# Altium schematic sheet Sheet1.SchDoc
size A4
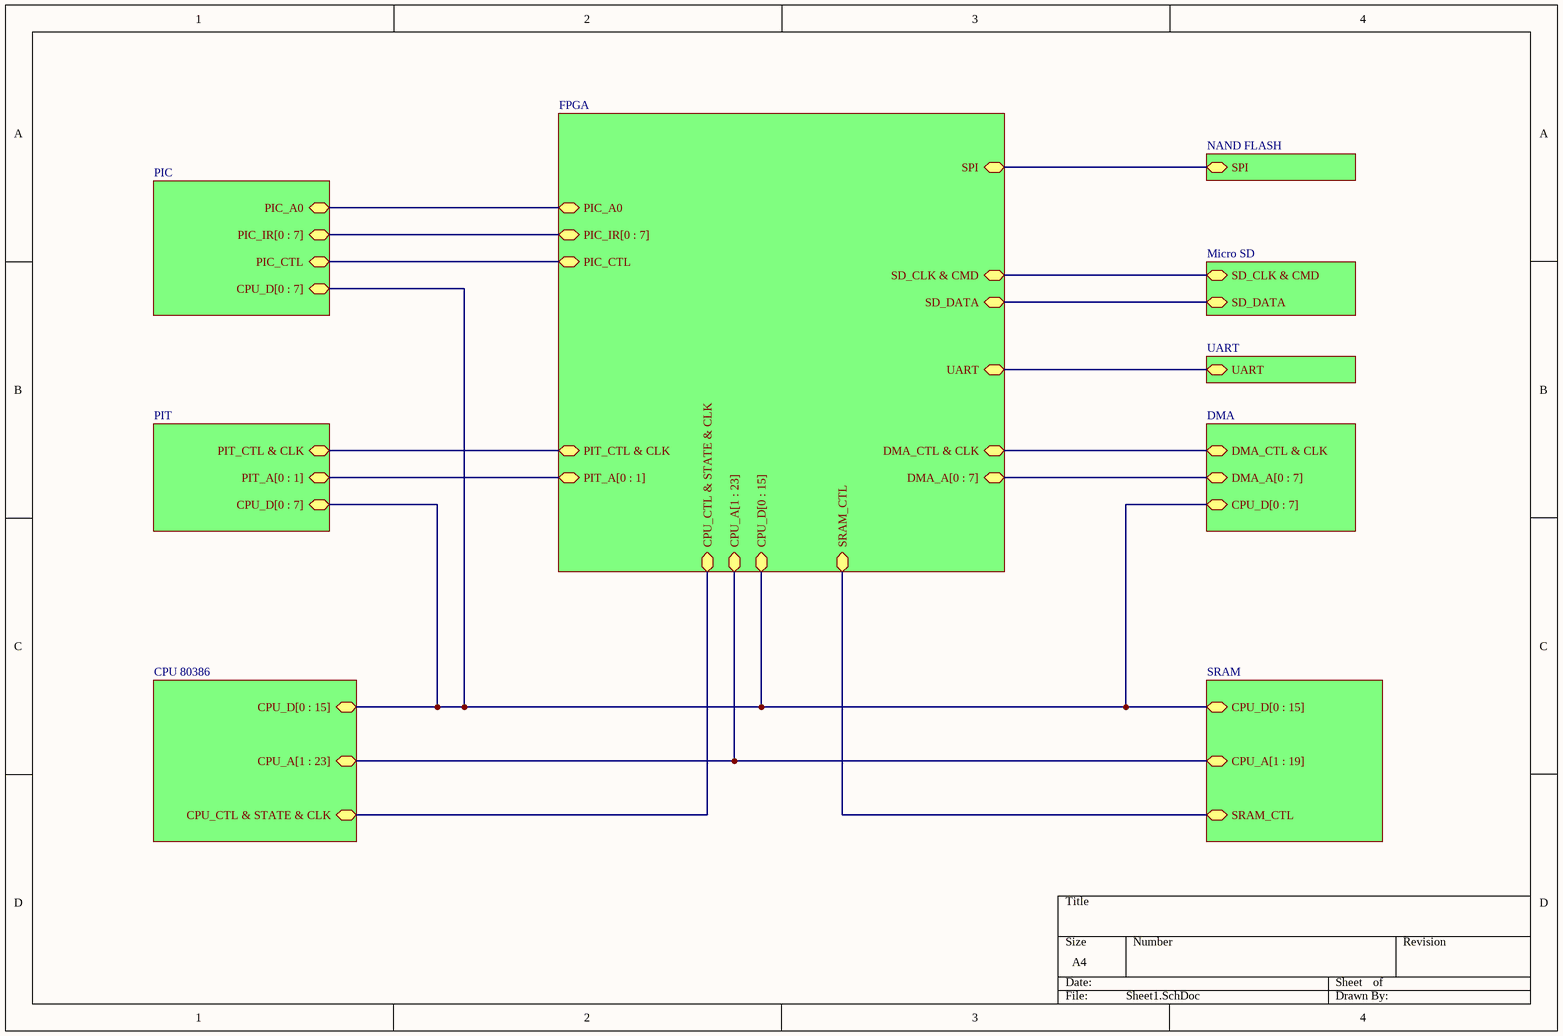
[diagram p0: Sheet1.SchDoc]

## Sub-sheets
CPU 80386 = File Name: CPU_CTL & STATE & CLK (bidir), CPU_D[0 : 15] (bidir), CPU_A[1 : 23] (bidir)
DMA = File Name: DMA_CTL & CLK (bidir), DMA_A[0 : 7] (bidir), CPU_D[0 : 7] (bidir)
FPGA = File Name: DMA_CTL & CLK (bidir), DMA_A[0 : 7] (bidir), PIT_CTL & CLK (bidir), PIT_A[0 : 1] (bidir), SRAM_CTL (bidir), CPU_CTL & STATE & CLK (bidir), CPU_A[1 : 23] (bidir), CPU_D[0 : 15] (bidir), PIC_CTL (bidir), PIC_IR[0 : 7] (bidir), PIC_A0 (bidir), SPI (bidir), SD_CLK & CMD (bidir), SD_DATA (bidir), UART (bidir)
Micro SD = File Name: SD_CLK & CMD (bidir), SD_DATA (bidir)
NAND FLASH = File Name: SPI (bidir)
PIC = File Name: CPU_D[0 : 7] (bidir), PIC_CTL (bidir), PIC_IR[0 : 7] (bidir), PIC_A0 (bidir)
PIT = File Name: PIT_CTL & CLK (bidir), PIT_A[0 : 1] (bidir), CPU_D[0 : 7] (bidir)
SRAM = File Name: SRAM_CTL (bidir), CPU_A[1 : 19] (bidir), CPU_D[0 : 15] (bidir)
UART = File Name: UART (bidir)

## Nets
(unnamed): sheet CPU 80386/CPU_CTL & STATE & CLK, sheet FPGA/CPU_CTL & STATE & CLK
(unnamed): sheet CPU 80386/CPU_D[0 : 15], sheet SRAM/CPU_D[0 : 15], sheet FPGA/CPU_D[0 : 15], sheet DMA/CPU_D[0 : 7], sheet PIT/CPU_D[0 : 7], sheet PIC/CPU_D[0 : 7]
(unnamed): sheet CPU 80386/CPU_A[1 : 23], sheet SRAM/CPU_A[1 : 19], sheet FPGA/CPU_A[1 : 23]
(unnamed): sheet SRAM/SRAM_CTL, sheet FPGA/SRAM_CTL
(unnamed): sheet FPGA/DMA_CTL & CLK, sheet DMA/DMA_CTL & CLK
(unnamed): sheet FPGA/DMA_A[0 : 7], sheet DMA/DMA_A[0 : 7]
(unnamed): sheet FPGA/PIT_CTL & CLK, sheet PIT/PIT_CTL & CLK
(unnamed): sheet FPGA/PIT_A[0 : 1], sheet PIT/PIT_A[0 : 1]
(unnamed): sheet FPGA/PIC_CTL, sheet PIC/PIC_CTL
(unnamed): sheet FPGA/PIC_IR[0 : 7], sheet PIC/PIC_IR[0 : 7]
(unnamed): sheet FPGA/PIC_A0, sheet PIC/PIC_A0
(unnamed): sheet FPGA/SPI, sheet NAND FLASH/SPI
(unnamed): sheet FPGA/SD_CLK & CMD, sheet Micro SD/SD_CLK & CMD
(unnamed): sheet FPGA/SD_DATA, sheet Micro SD/SD_DATA
(unnamed): sheet FPGA/UART, sheet UART/UART